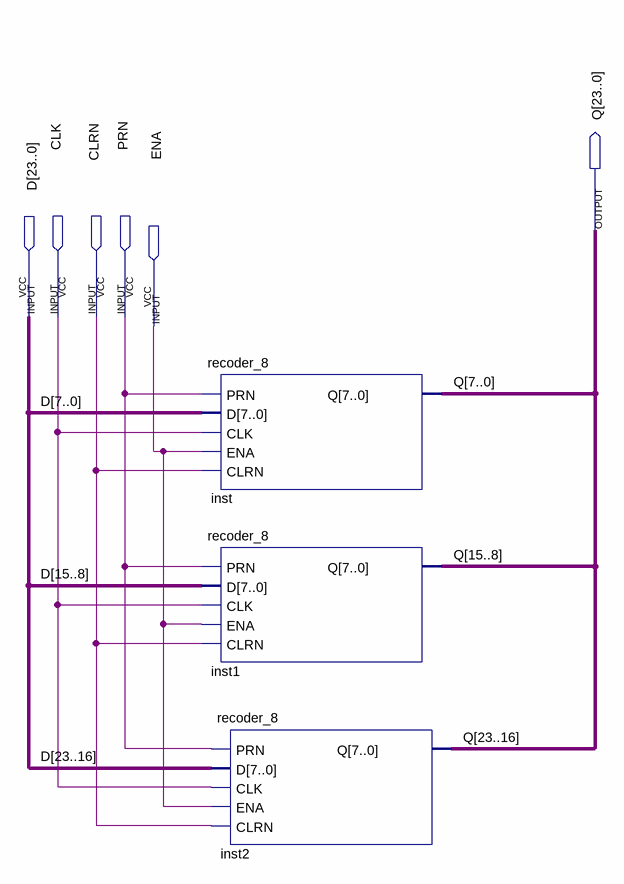
[diagram p0: schematic sheet]
// Quartus schematic recoder_24.bdf as structural Verilog: 3 symbols, 6 pins
module recoder_24 (
  input  [23:0] D,
  input  CLK,
  input  CLRN,
  input  PRN,
  input  ENA,
  output [23:0] Q
);

  recoder_8 inst (.PRN(PRN), .D(D[7:0]), .CLK(CLK), .ENA(ENA), .CLRN(CLRN), .Q(Q[7:0]));
  recoder_8 inst1 (.PRN(PRN), .D(D[15:8]), .CLK(CLK), .ENA(ENA), .CLRN(CLRN), .Q(Q[15:8]));
  recoder_8 inst2 (.PRN(PRN), .D(D[23:16]), .CLK(CLK), .ENA(ENA), .CLRN(CLRN), .Q(Q[23:16]));
endmodule
